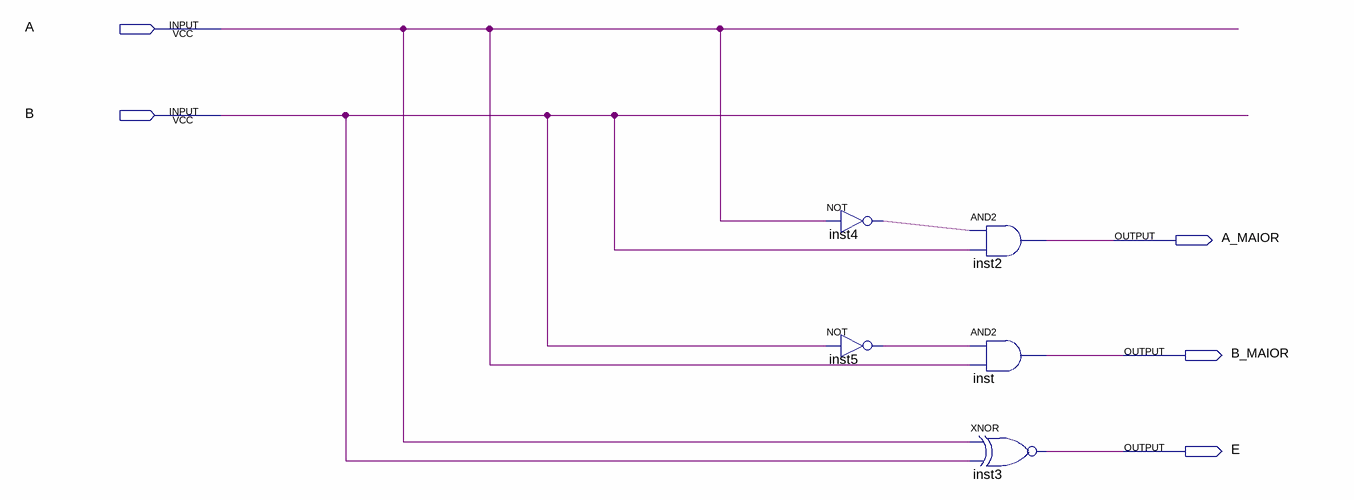
[diagram p0: schematic sheet]
// Quartus schematic Block7.bdf as structural Verilog: 5 symbols, 5 pins
module Block7 (
  input  A,
  input  B,
  output A_MAIOR,
  output B_MAIOR,
  output E
);

  wire inst4_out, inst5_out;

  not inst4 (inst4_out, A);
  not inst5 (inst5_out, B);
  and inst2 (A_MAIOR, inst4_out, B);
  and inst (B_MAIOR, inst5_out, A);
  xnor inst3 (E, A, B);
endmodule
